# EasyEDA Pro project MIoTEvBoard_A.epro, schematic Schematic

## Sheets
1 Controller
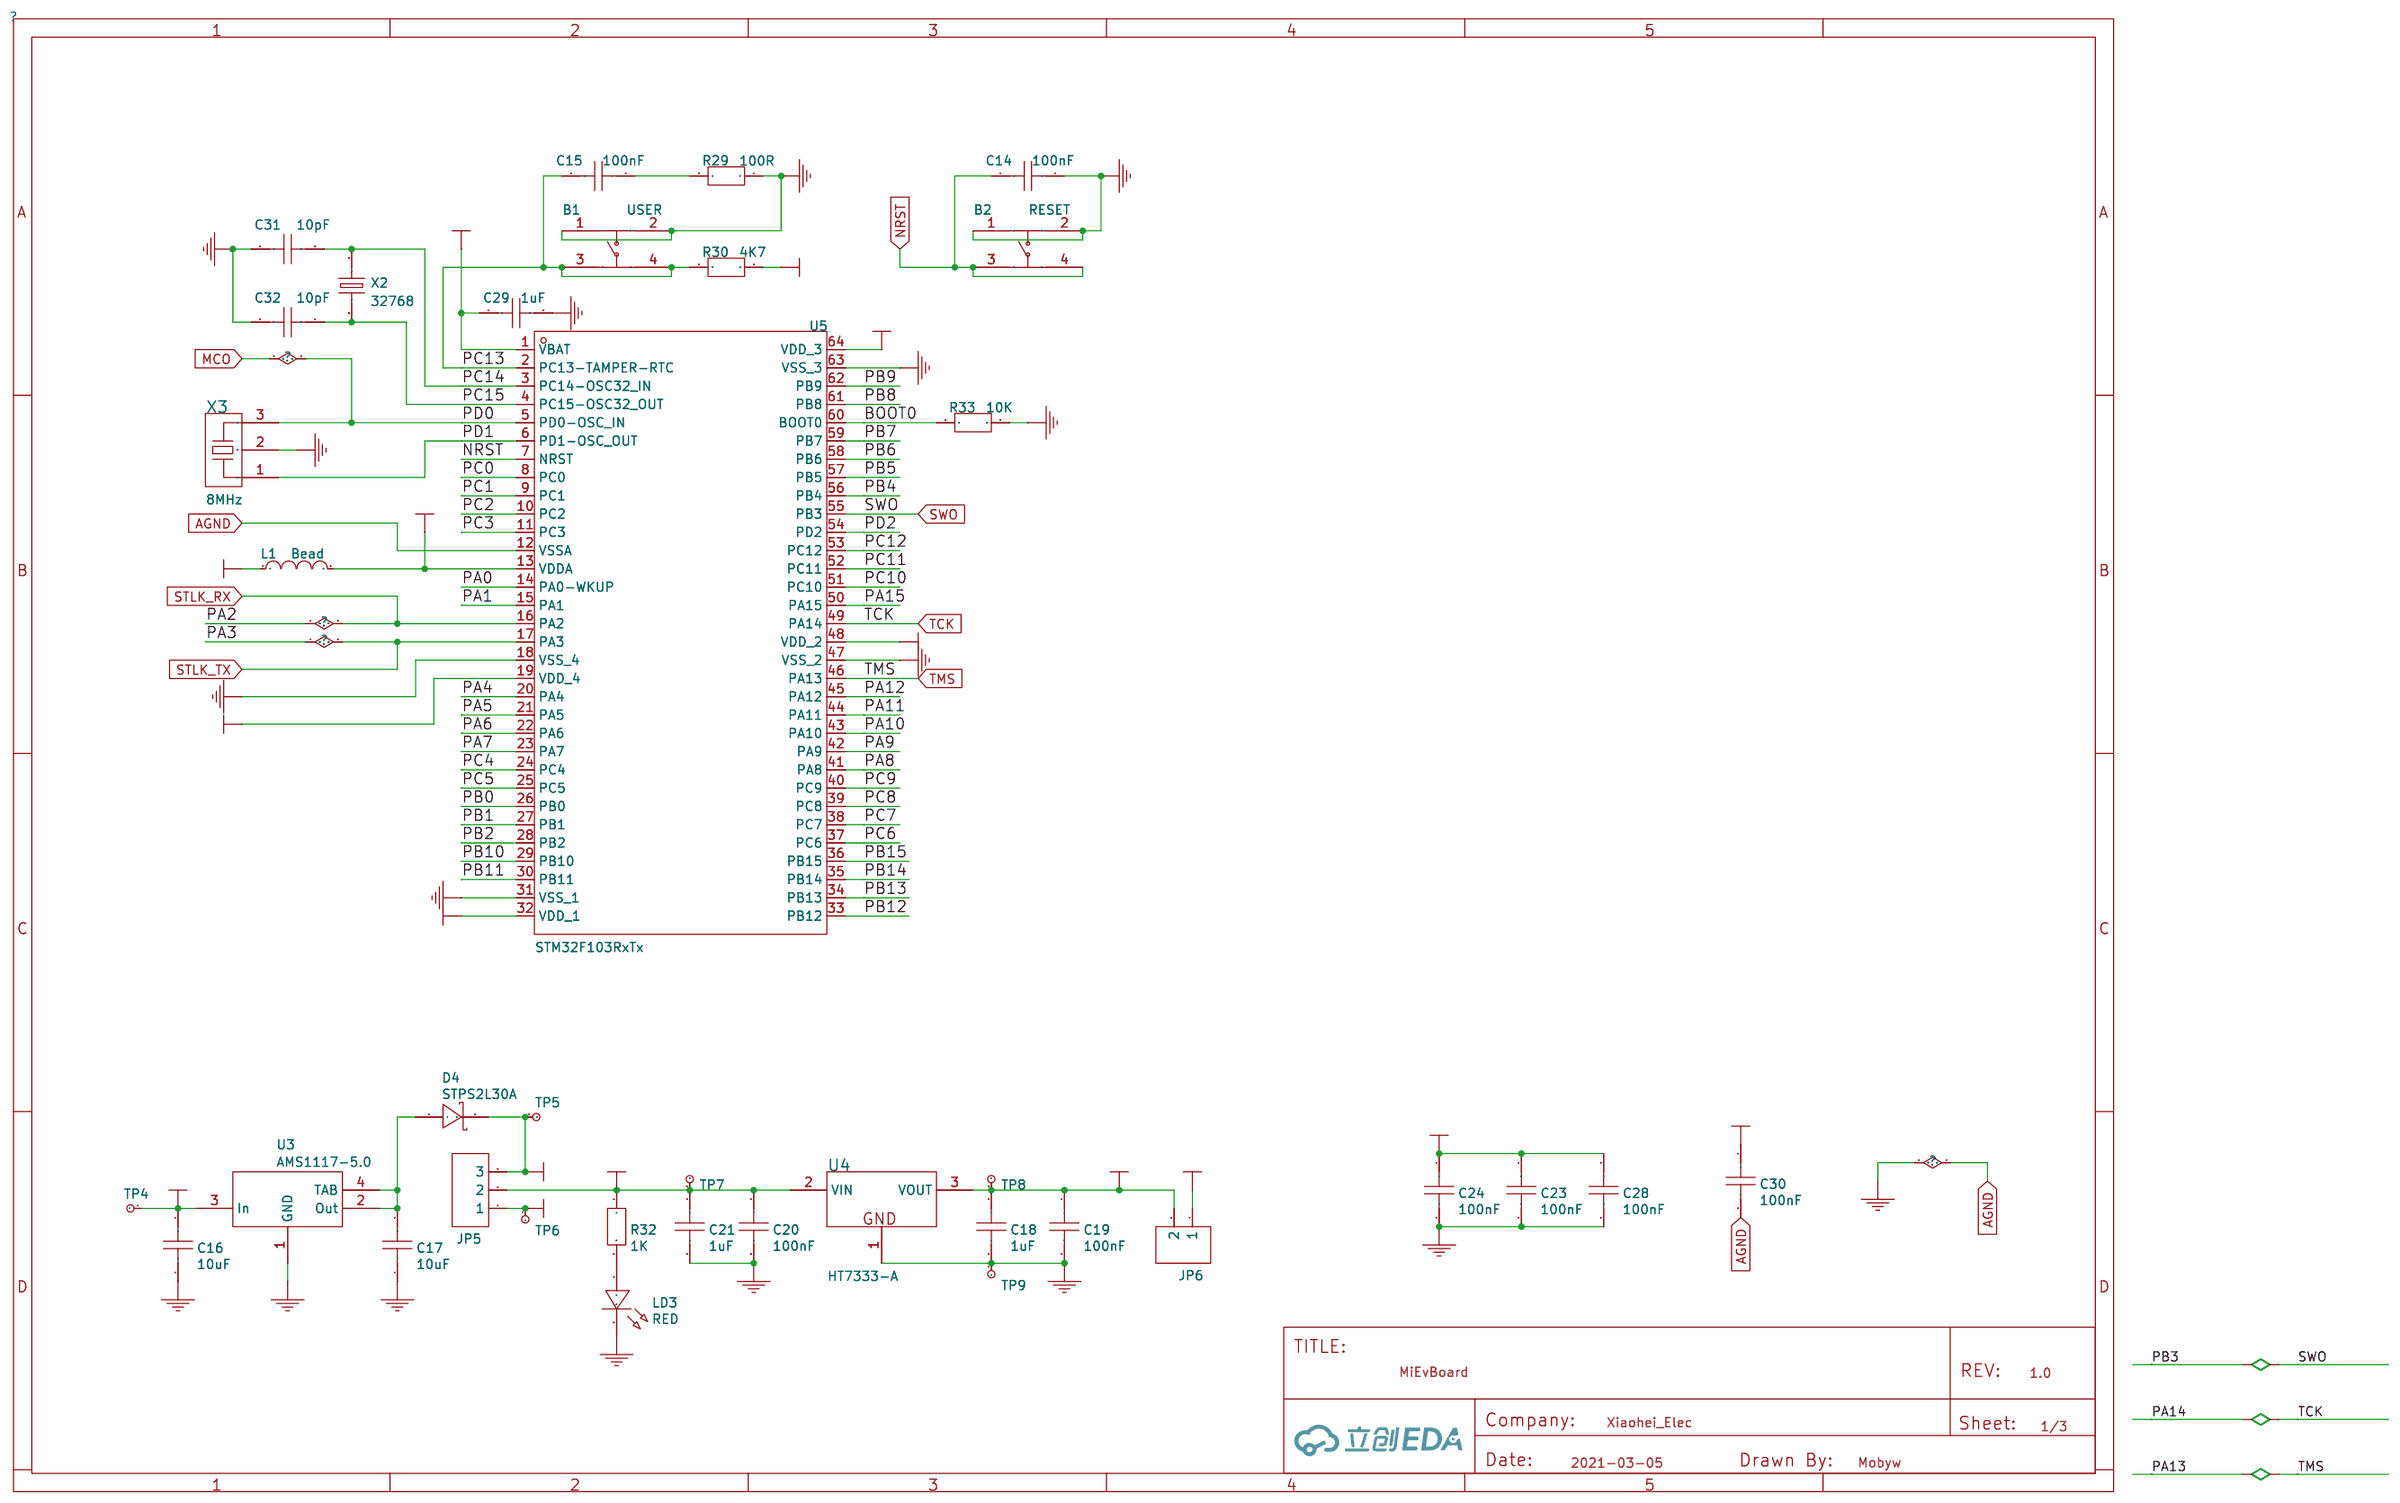
[diagram p0: Controller]
2 Simulator
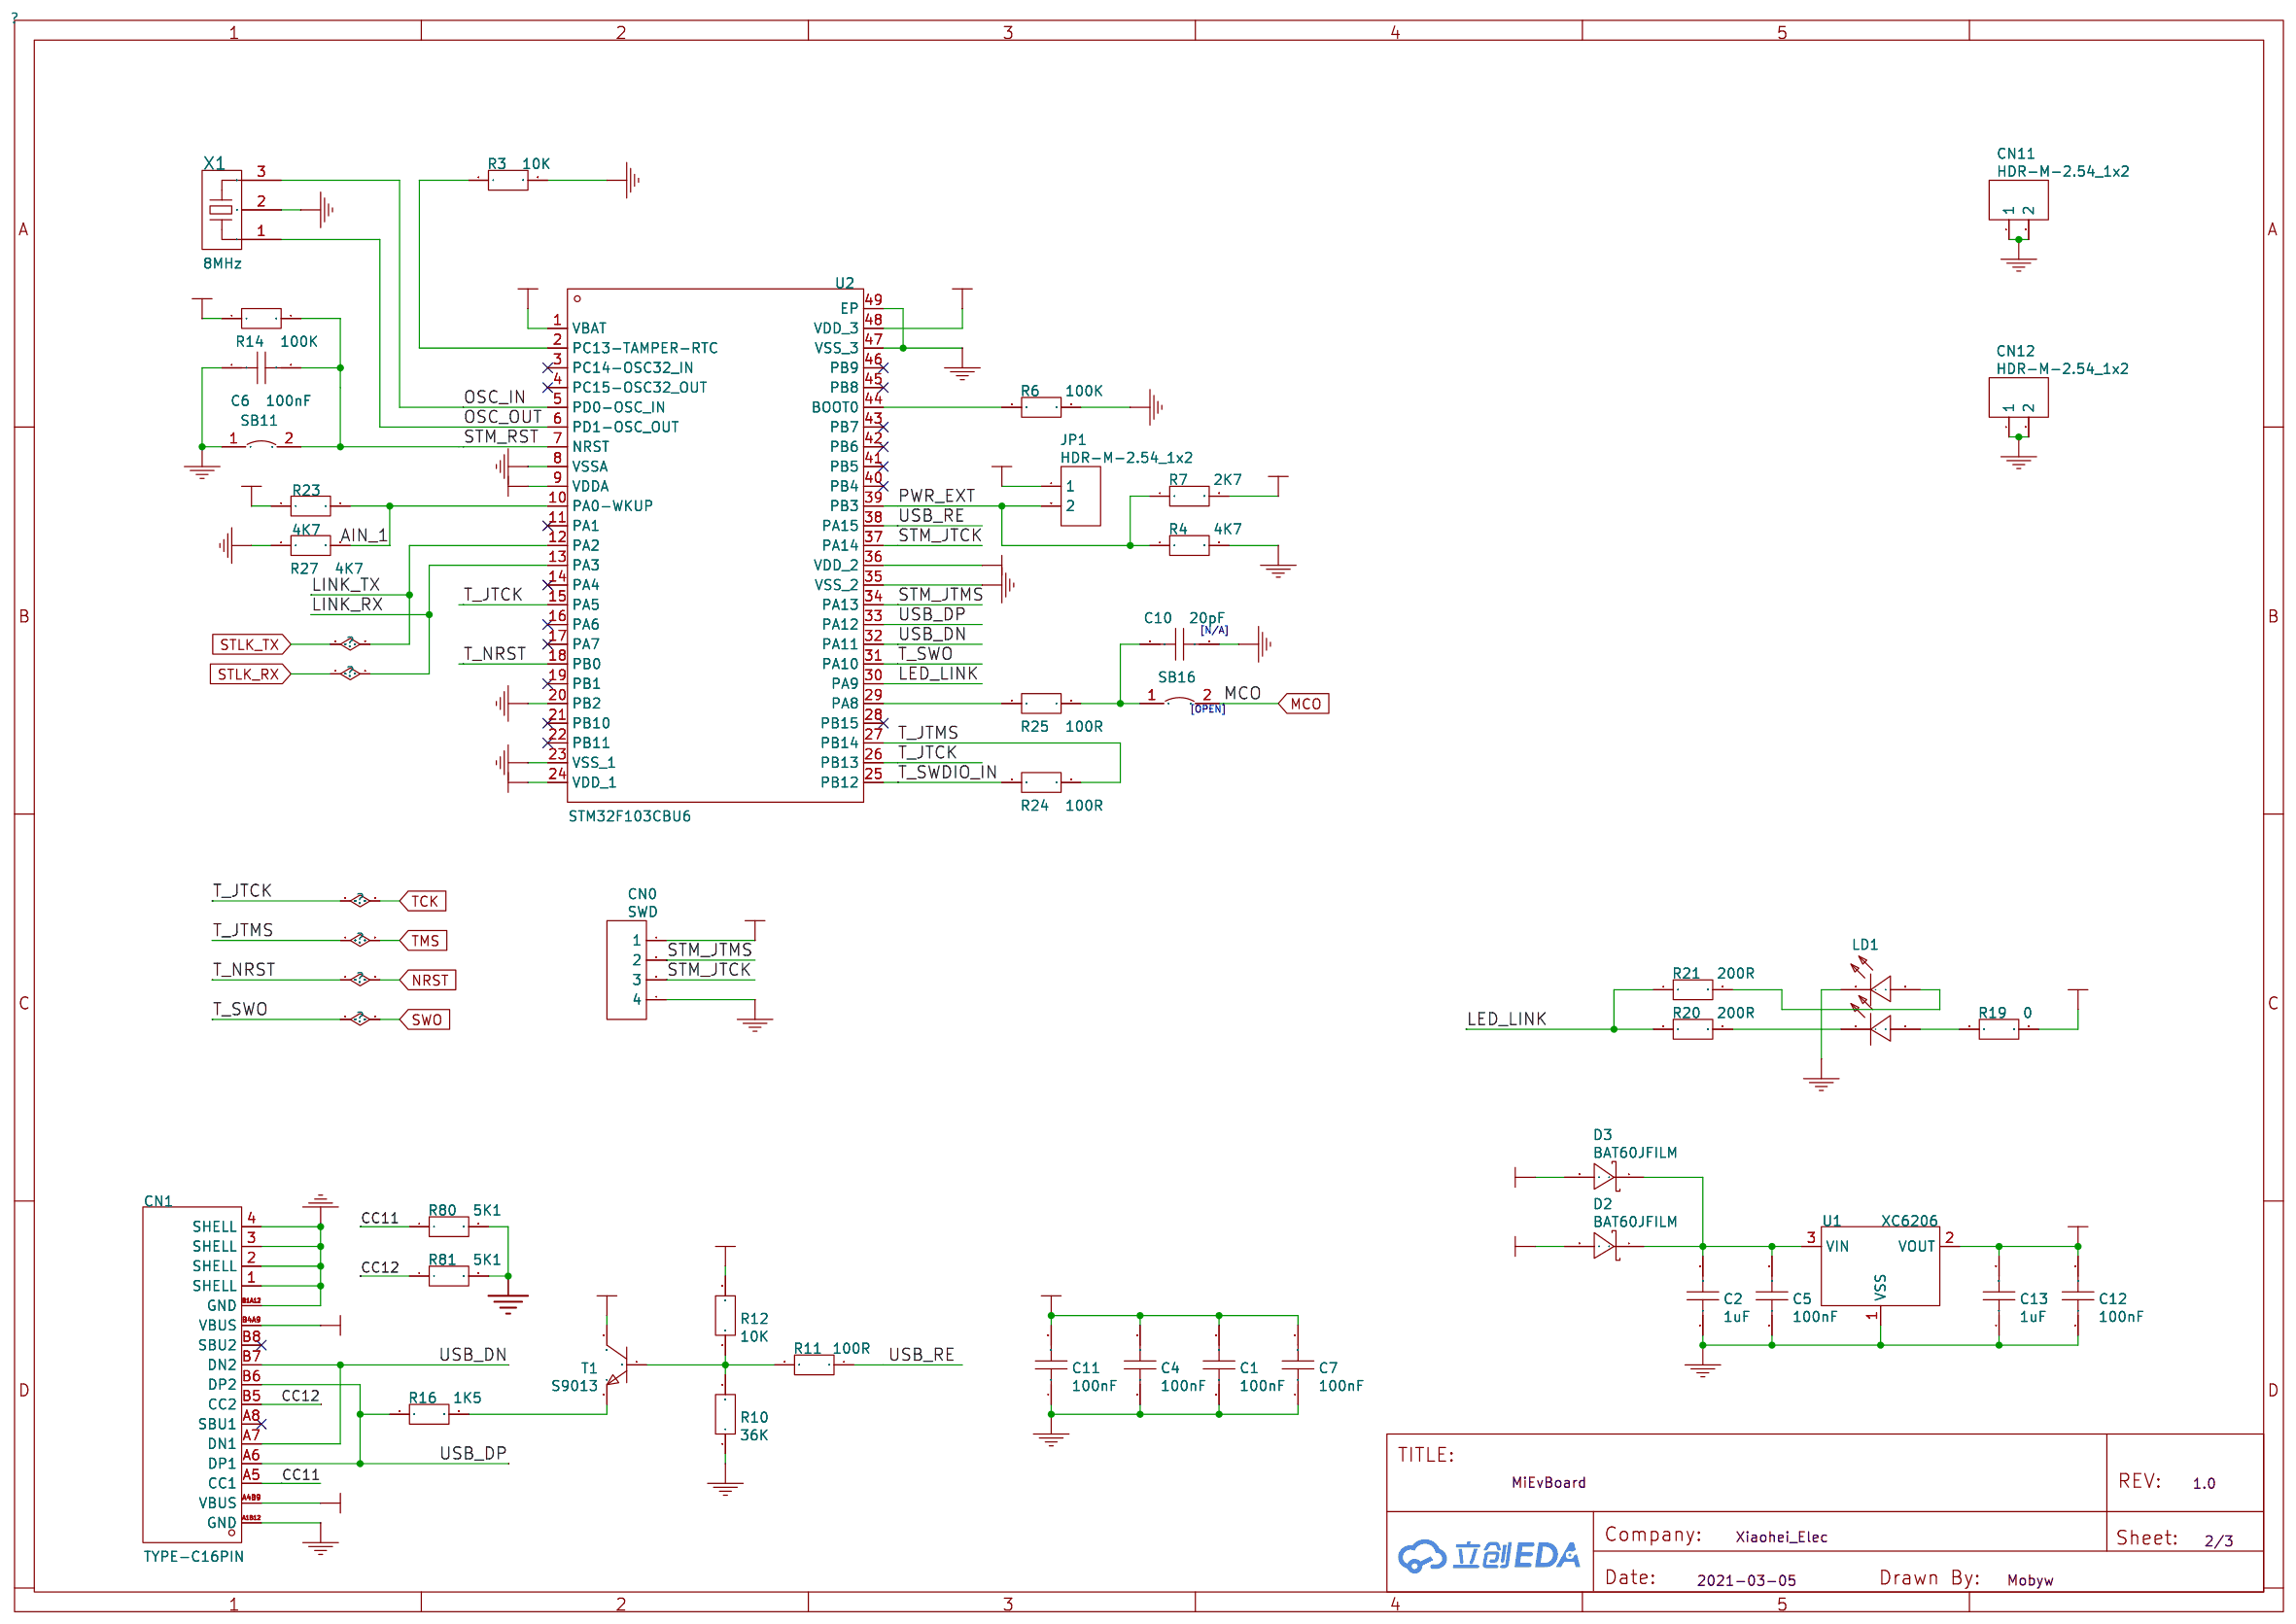
[diagram p1: Simulator]
3 Connector
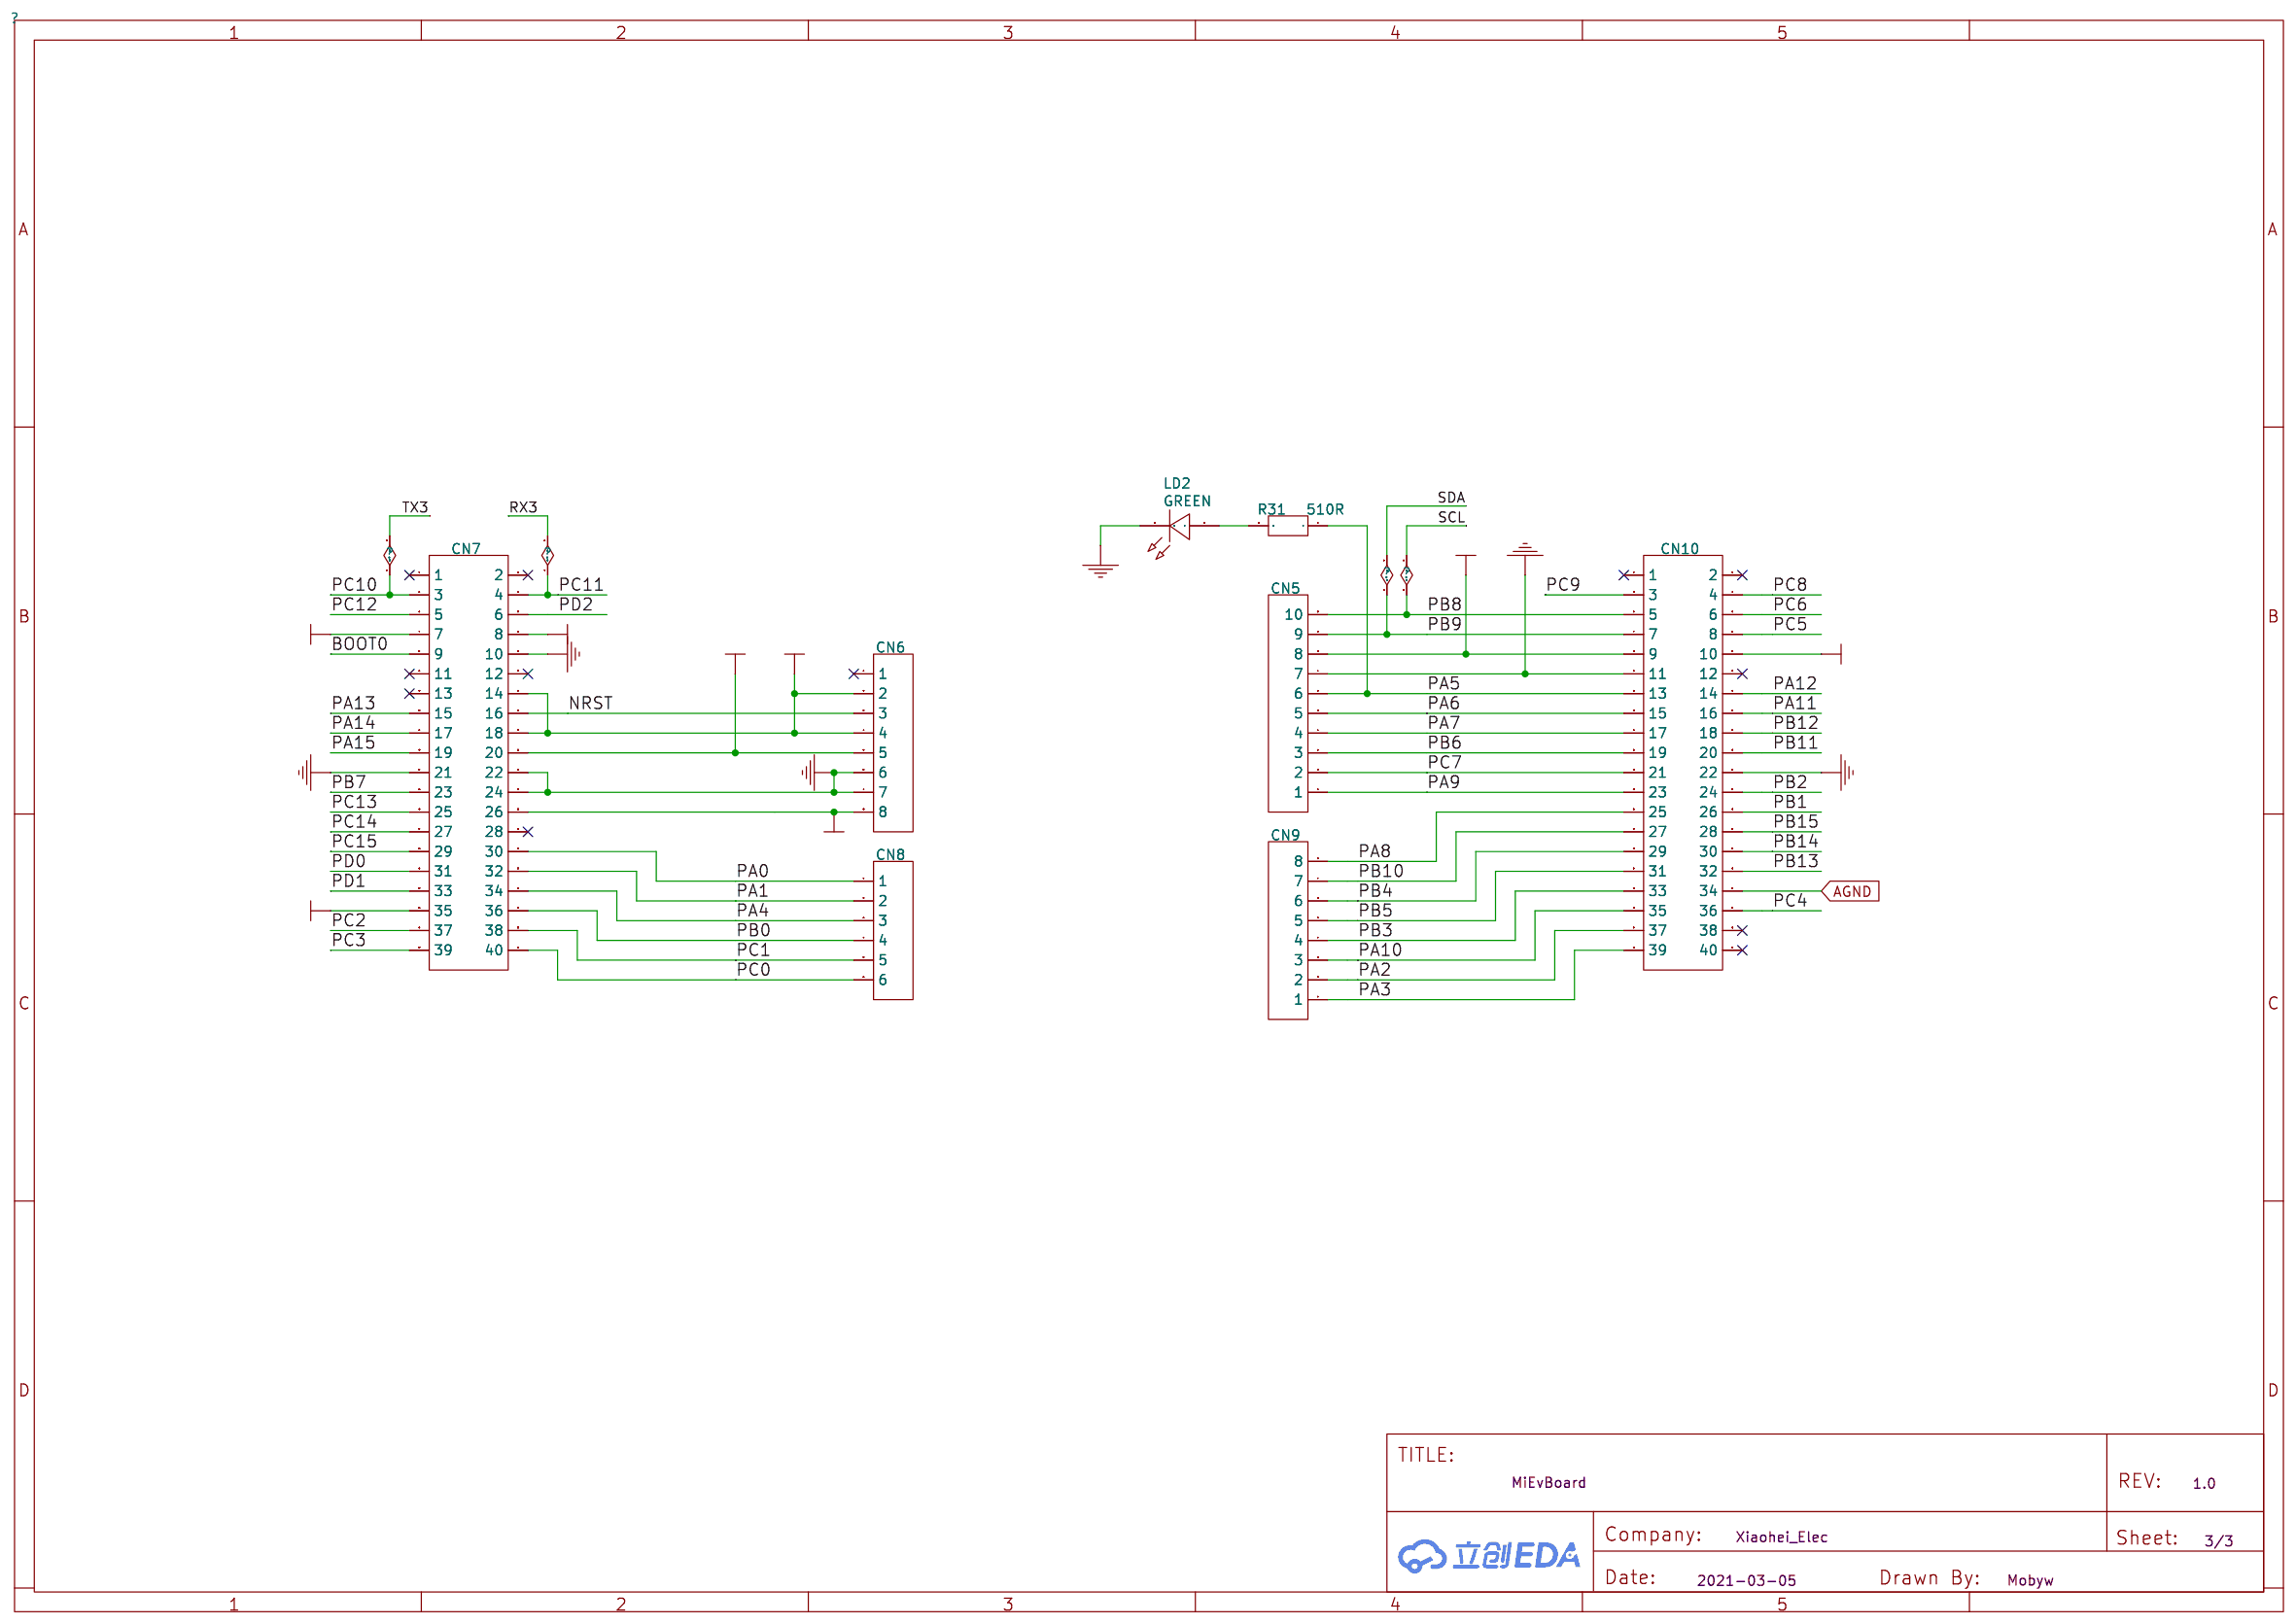
[diagram p2: Connector]
4 Communicator: Create Date: 2024-01-20; Page Name: Communicator; Project Name: MiEvBoard; Schematic Name: MI-NUCLEO-64; Update Date: 2024-01-21; Company: 嘉立创EDA; Page Size: A4; Version: V1.0
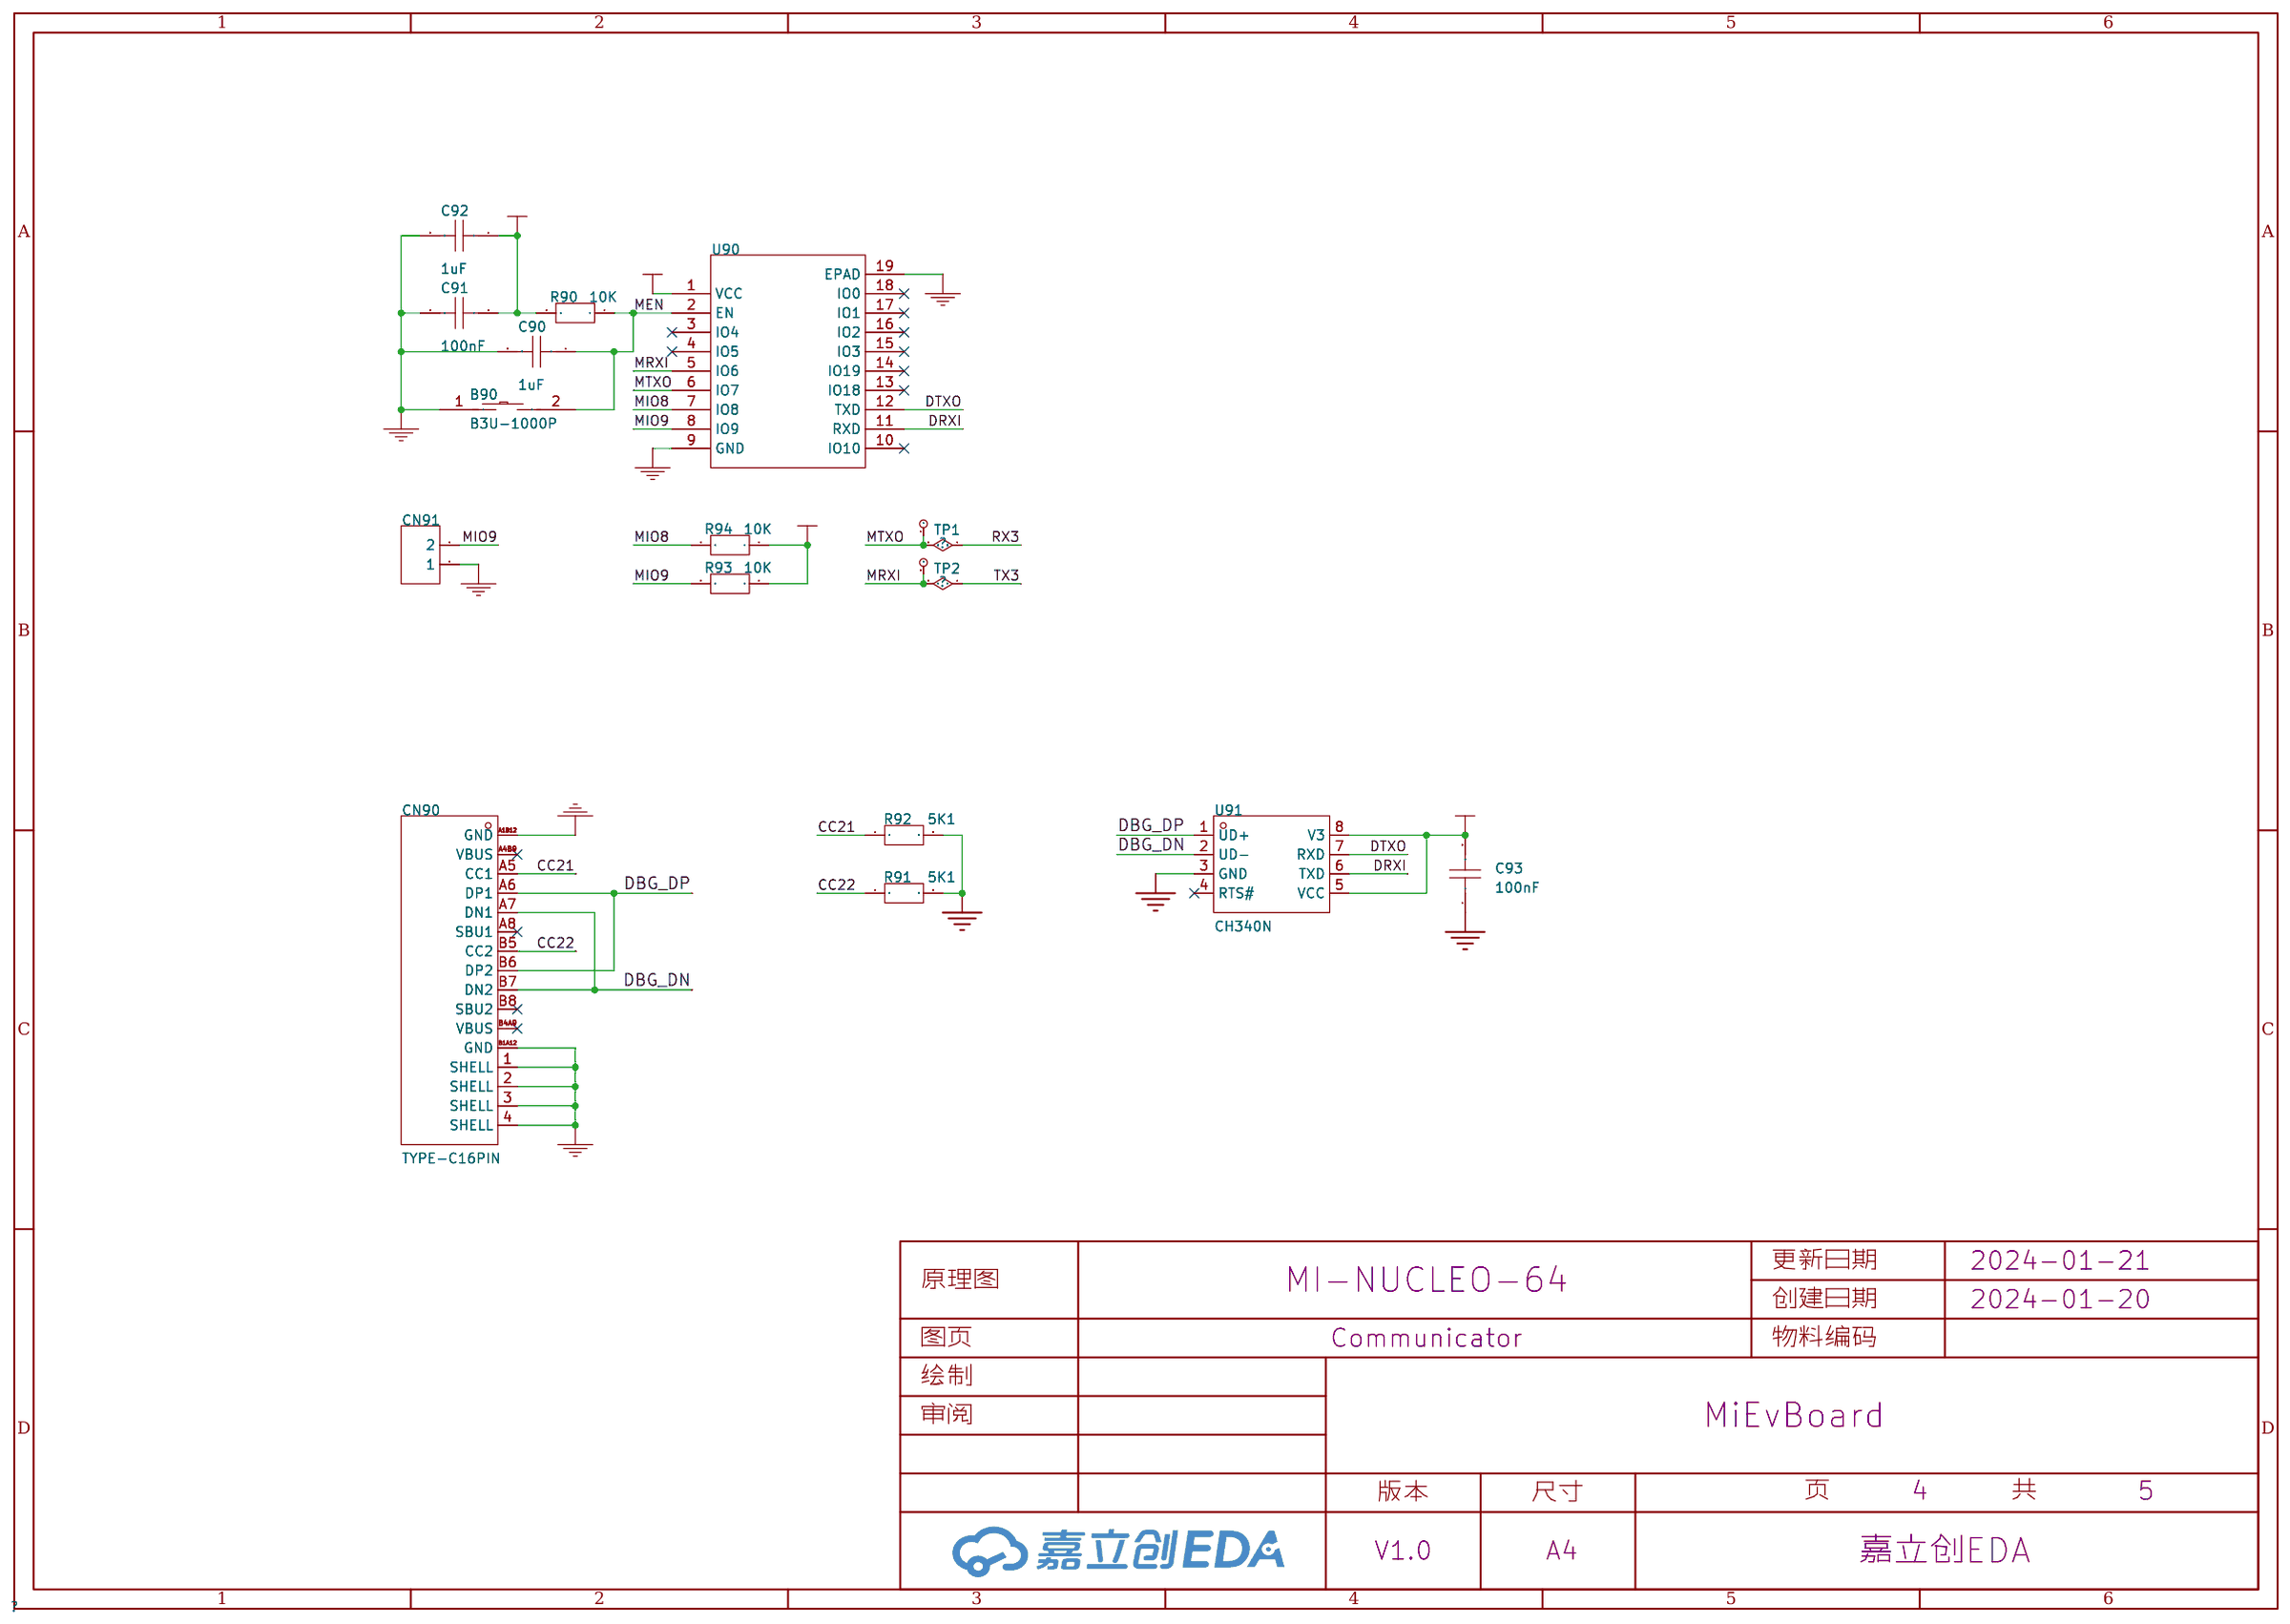
[diagram p3: Communicator]
5 Sensor: Create Date: 2024-01-21; Page Name: Sensor; Project Name: MiEvBoard; Schematic Name: MI-NUCLEO-64; Update Date: 2024-01-24; Company: 嘉立创EDA; Page Size: A4; Version: V1.0
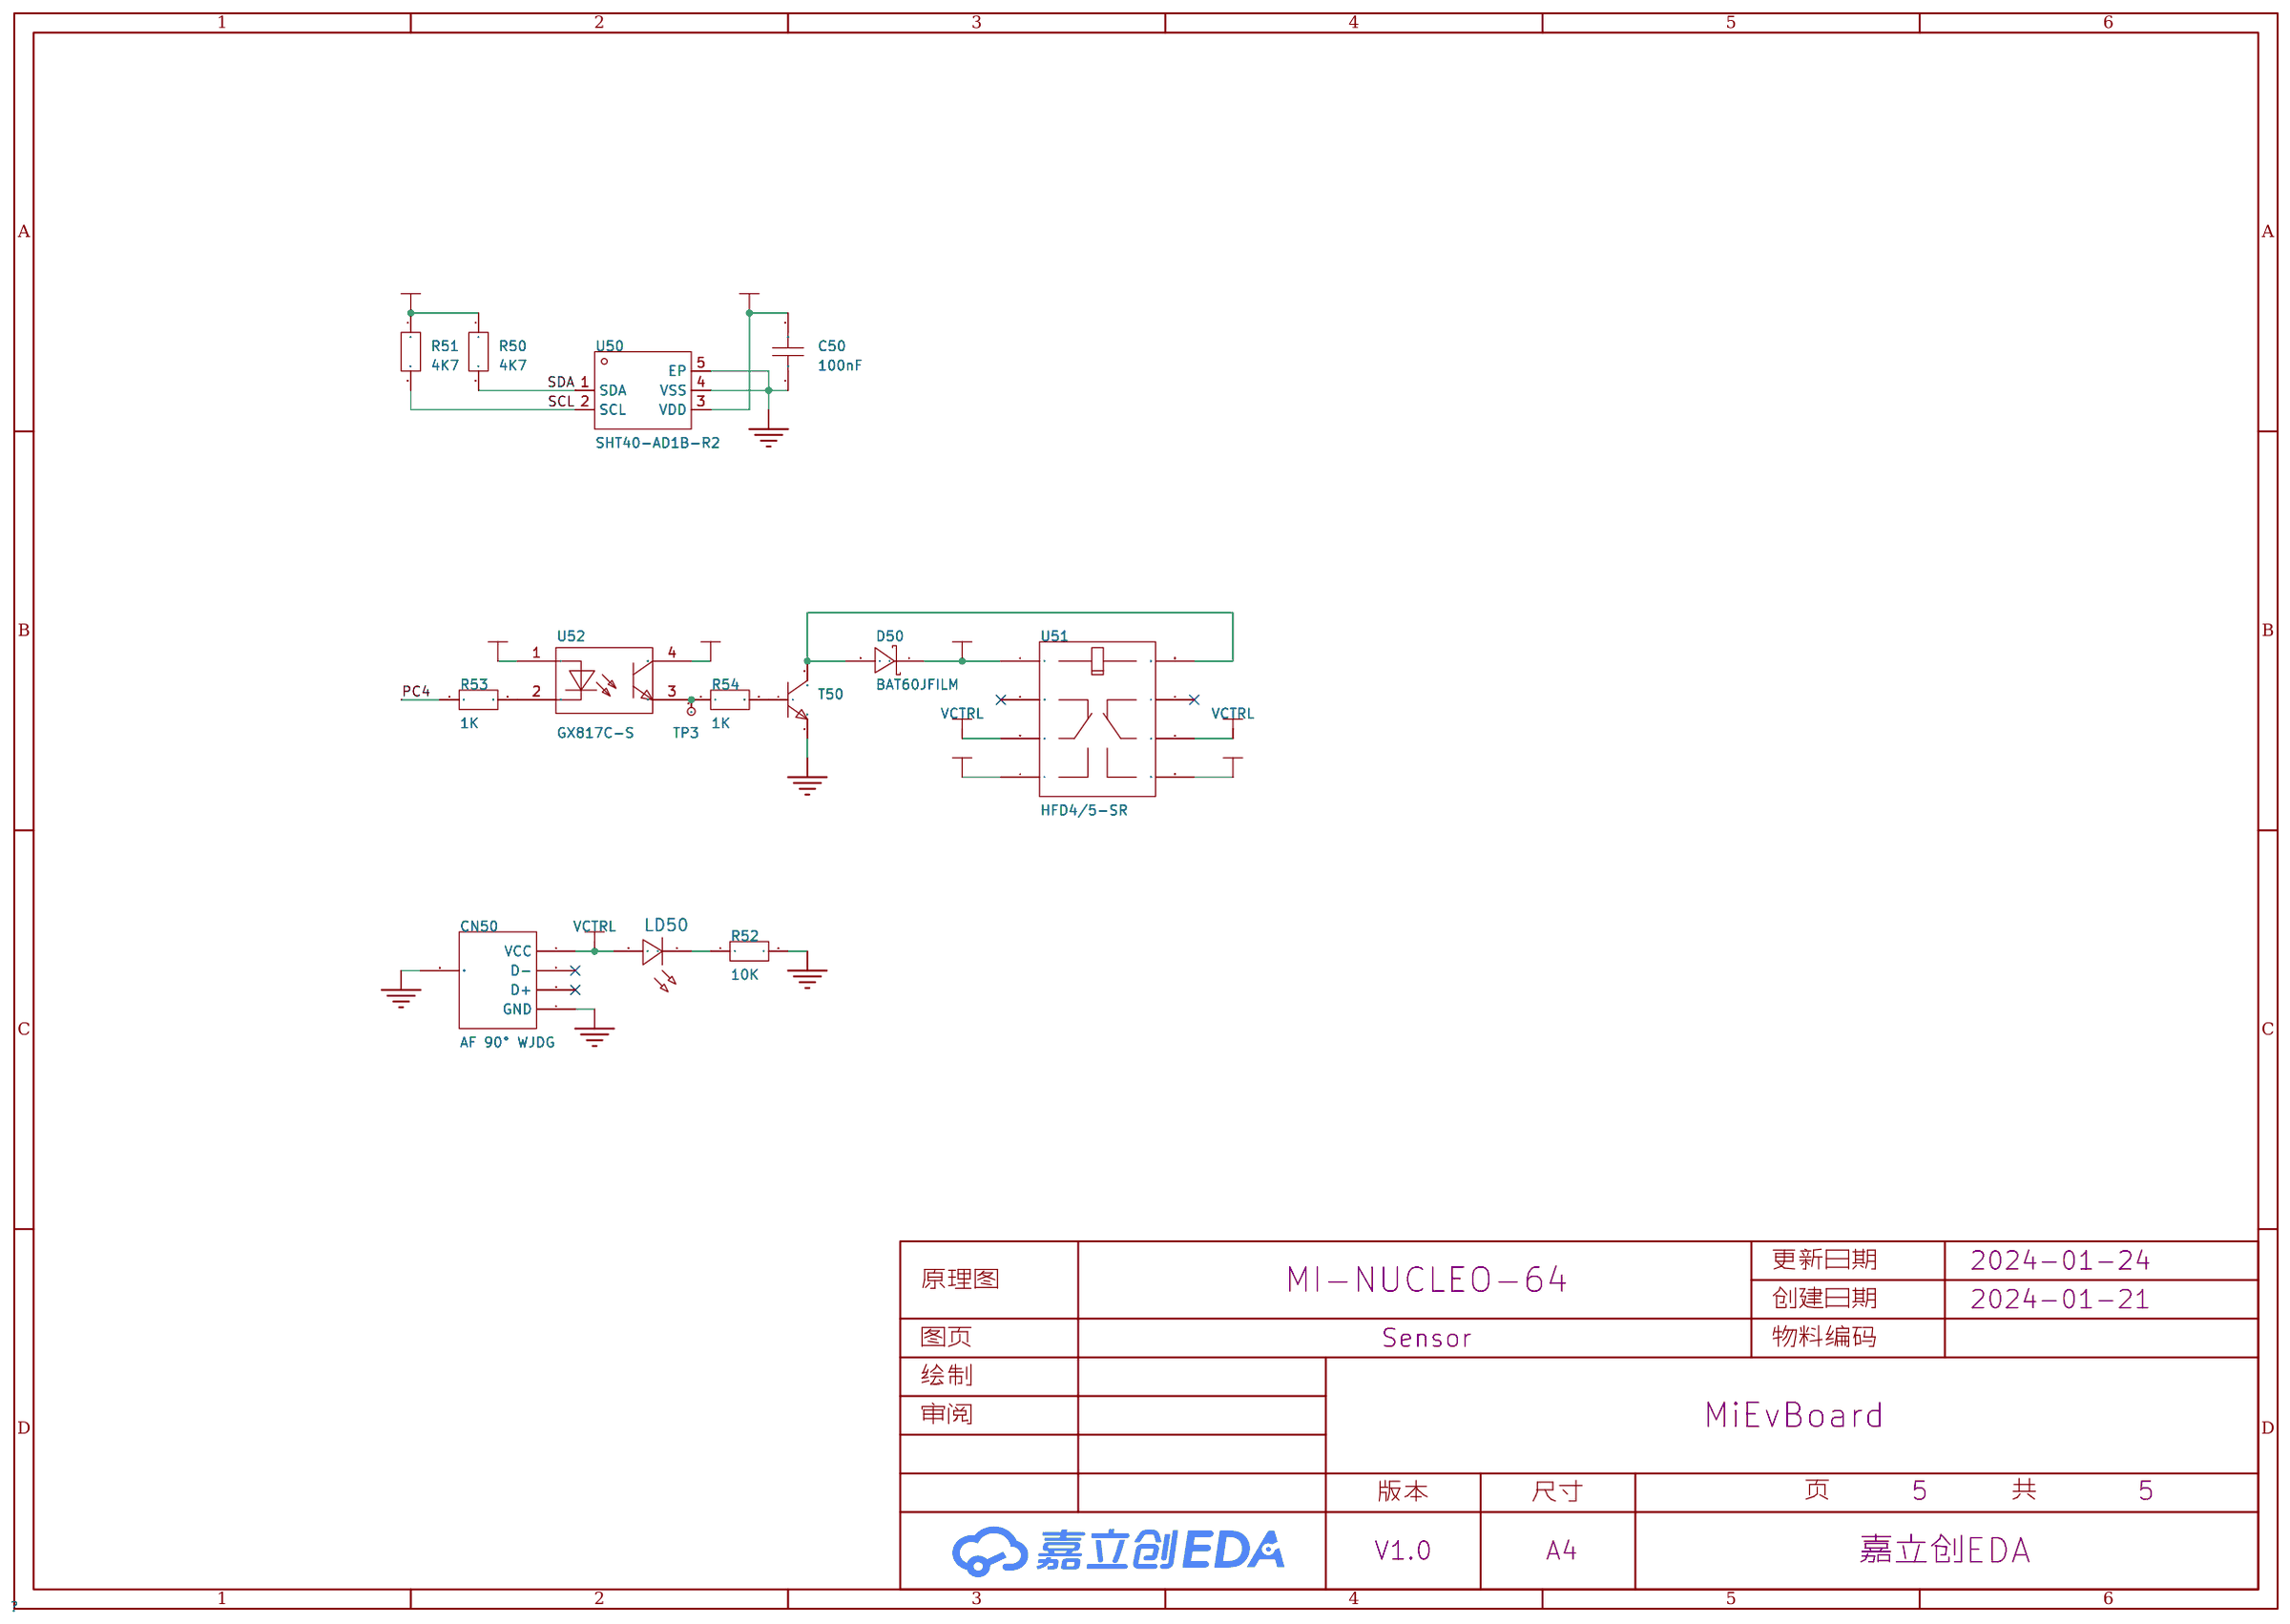
[diagram p4: Sensor]

## Parts
sheet Communicator
B90  B3U-1000P  [KEY-SMD_B3U-1000PM]
C90  1uF  [C0603]
C91  100nF  [C0603]
C92  1uF  [C0603]
C93  100nF  [C0603]
CN90  TYPE-C16PIN  [USB-C-SMD_TYPE-C16PIN]
CN91  HDR-M-2.54_1x2  [HDR-M-2.54_1X2]
R90  10K  [R0603]
R91  5K1  [R0603]
R92  5K1  [R0603]
R93  10K  [R0603]
R94  10K  [R0603]
TP1  -  [TP-Round-1.0]
TP2  -  [TP-Round-1.0]
U90  -  [MHCWB6G-B]
U91  CH340N  [SOP-8_L4.9-W3.9-P1.27-LS6.0-BL]
sheet Connector
CN5  HDR-F-2.54_1x10  [HDR-F-2.54_1X10]
CN6  HDR-F-2.54_1x8  [HDR-F-2.54_1X8]
CN7  HDR-M-2.54_2x20  [HDR-M-2.54_2X20]
CN8  HDR-F-2.54_1x6  [HDR-F-2.54_1X6]
CN9  HDR-F-2.54_1x8  [HDR-F-2.54_1X8]
CN10  HDR-M-2.54_2x20  [HDR-M-2.54_2X20]
LD2  GREEN  [LED0603_GREEN]
R31  510R  [R0603]
sheet Controller
B1  USER  [KEY-SMD_4P-L6.0-W6.0-P3.90-LS9.0]
B2  RESET  [KEY-SMD_4P-L6.0-W6.0-P3.90-LS9.0]
C14  100nF  [C0603]
C15  100nF  [C0603]
C16  10uF  [C0805]
C17  10uF  [C0805]
C18  1uF  [C0603]
C19  100nF  [C0603]
C20  100nF  [C0603]
C21  1uF  [C0603]
C23  100nF  [C0603]
C24  100nF  [C0603]
C28  100nF  [C0603]
C29  1uF  [C0603]
C30  100nF  [C0603]
C31  10pF  [C0603]
C32  10pF  [C0603]
D4  STPS2L30A  [SMA_L4.4-W2.8-LS5.4-RD]
JP5  HDR-M-2.54_1x3  [HDR-M-2.54_1X3]
JP6  HDR-M-2.54_1x2  [HDR-M-2.54_1X2]
L1  Bead  [L0603]
LD3  RED  [LED0603_RED]
R29  100R  [R0603]
R30  4K7  [R0603]
R32  1K  [R0603]
R33  10K  [R0603]
TP4  -  [TP-Round-1.0]
TP5  -  [TP-Round-1.0]
TP6  -  [TP-Round-1.0]
TP7  -  [TP-Round-1.0]
TP8  -  [TP-Round-1.0]
TP9  -  [TP-Round-1.0]
U3  AMS1117-5.0  [SOT-223_L6.5-W3.5-P2.30-LS7.0-BR]
U4  HT7333-A  [SOT-89-3_L4.5-W2.5-P1.50-LS4.2-BR]
U5  STM32F103RxTx  [LQFP-64_L10.0-W10.0-P0.50-LS12.0-BL]
X2  32768  [OSC-SMD_L3.2-W1.5]
X3  8MHz  [OSC-SMD_3P-L3.2-W1.3-P1.2-L]
sheet Sensor
C50  100nF  [C0603]
CN50  AF 90° WJDG  [USB-A-TH_AF-WJDG]
D50  BAT60JFILM  [SOD-323_L1.8-W1.3-LS2.5-RD]
LD50  -  [LED_0603]
R50  4K7  [R0603]
R51  4K7  [R0603]
R52  10K  [R0603]
R53  1K  [R0603]
R54  1K  [R0603]
T50  -  [S8050_SOT-23]
TP3  -  [TP-Round-1.0]
U50  SHT40-AD1B-R2  [DFN-4_L1.5-W1.5-P0.8-TL-EP]
U51  HFD4/5-SR  [RELAY-SMD_HFD4-5-SR]
U52  GX817C-S  [SOP-4_L6.5-W4.6-P2.54-LS10.2-TR]
sheet Simulator
C1  100nF  [C0603]
C2  1uF  [C0603]
C4  100nF  [C0603]
C5  100nF  [C0603]
C6  100nF  [C0603]
C7  100nF  [C0603]
C10  20pF  [C0603]
C11  100nF  [C0603]
C12  100nF  [C0603]
C13  1uF  [C0603]
CN0  SWD  [烧录点4P-2.54MM]
CN1  TYPE-C16PIN  [USB-C-SMD_TYPE-C16PIN]
CN11  HDR-M-2.54_1x2  [HDR-M-2.54_1X2]
CN12  HDR-M-2.54_1x2  [HDR-M-2.54_1X2]
D2  BAT60JFILM  [SOD-323_L1.8-W1.3-LS2.5-RD]
D3  BAT60JFILM  [SOD-323_L1.8-W1.3-LS2.5-RD]
JP1  HDR-M-2.54_1x2  [HDR-M-2.54_1X2]
LD1  MHT194CRCGCT  [LED-ARRAY-SMD_4P-0605-L1.60-W1.50-BL]
R3  10K  [R0603]
R4  4K7  [R0603]
R6  100K  [R0603]
R7  2K7  [R0603]
R10  36K  [R0603]
R11  100R  [R0603]
R12  10K  [R0603]
R14  100K  [R0603]
R16  1K5  [R0603]
R19  0  [R0603]
R20  200R  [R0603]
R21  200R  [R0603]
R23  4K7  [R0603]
R24  100R  [R0603]
R25  100R  [R0603]
R27  4K7  [R0603]
R80  5K1  [R0603]
R81  5K1  [R0603]
SB11  ShortPad  [SOLDERJUMPER_2_OPEN_0603]
SB16  ShortPad  [SOLDERJUMPER_2_OPEN_0603]
T1  S9013  [SOT-23-3_L2.9-W1.3-P1.90-LS2.4-BR]
U1  XC6206  [SOT-23-3_L2.9-W1.3-P1.90-LS2.4-BR]
U2  STM32F103CBU6  [UFQFPN-48_L7.0-W7.0-P0.50-BL-EP]
X1  8MHz  [OSC-SMD_3P-L3.2-W1.3-P1.2-L]

## Library data of the parts
B90 = B3U-1000P: 触点电流:50mA;额定电压(DC):12V;电路结构:单刀单掷;安装方式:立贴;带灯:-;机械寿命:-;; LCSC Part Name: 3*2.5*1.6mm 立贴 轻触开关; Supplier Part: C231329; Manufacturer: OMRON(欧姆龙); Supplier Footprint: SMD,2.5x3mm; JLCPCB Part Class: 扩展库; Datasheet: https://atta.szlcsc.com/upload/public/pdf/source/20180629/C231329_070179C33643744C5978F4F02109B85D.pdf; Supplier: LCSC; Contact Current: 50mA; Voltage Rating (DC): 12V; Circuit: 单刀单掷; Mounting Style: 立贴; Actuator Style: 圆形按钮; Switch Length: 3mm; Switch Width: 2.5mm; Switch Height: 1.6mm
C2 C13 C18 C21 C29 C90 C92 = 1uF: link: https://item.szlcsc.com/362304.html; 3DModel: C0603_L1.6-W0.8-H0.8
C1 C4-C7 C11 C12 C14 C15 C19 C20 C23 C24 C28 C30 C50 C91 C93 = 100nF: link: https://item.szlcsc.com/362304.html; 3DModel: C0603_L1.6-W0.8-H0.8
CN1 CN90 = TYPE-C16PIN: 连接器类型:Type-C;标准:-;公母:母;端口数量:1;触点数量:16P;安装方式:卧贴;额定电流 - 电源:3A;工作温度范围:-40℃~+85℃;; LCSC Part Name: Type-C 母 卧贴; Supplier Part: C393939; Manufacturer: SHOU HAN(首韩); Supplier Footprint: SMD; JLCPCB Part Class: 扩展库; Datasheet: https://atta.szlcsc.com/upload/public/pdf/source/20190521/C393939_7B9043D4CF1026AF443AB60D91FBCD5C.pdf; Supplier: LCSC; Connector Type: Type-C; Gender: 母; Number of Ports: 1; Number of Contacts: 16P; Mounting Style: 卧贴; Current Rating - Power (Max): 3A; Operating Temperature Range: -40℃~+85℃
CN11 CN12 CN91 JP1 JP6 = HDR-M-2.54_1x2: Supplier Part: C124375; Supplier: LCSC
R3 R12 R33 R50-R54 R90 R93 R94 = 10K: link: https://item.szlcsc.com/137208.html; 3DModel: R0603_L1.6-W0.8-H0.8
R16 R80 R81 R91 R92 = 1K5: link: https://item.szlcsc.com/137208.html; 3DModel: R0603_L1.6-W0.8-H0.8
TP1-TP9 = TP-Round
U90 = MHCWB6G-B
U91 = CH340N: LCSC Part Name: USB转串口芯片 CH340; Supplier Part: C2977777; Manufacturer: WCH(南京沁恒); Supplier Footprint: SOP-8; JLCPCB Part Class: 扩展库; Datasheet: https://atta.szlcsc.com/upload/public/pdf/source/20230530/6E401E9554E9F5311886CC8B3F89B62E.pdf; Supplier: LCSC
CN5 = HDR-F-2.54_1x10: Supplier Part: C35445; Supplier: LCSC
CN6 CN9 = HDR-F-2.54_1x8: Supplier Part: C225505; Supplier: LCSC
CN7 CN10 = HDR-M-2.54_2x20: Supplier Part: C50980; Supplier: LCSC
CN8 = HDR-F-2.54_1x6: Supplier Part: C40877; Supplier: LCSC
LD2 = GREEN: 3DModel: LED0603_Green; Manufacturer: EVERLIGHT(台湾亿光); Manufacturer Part: 19-217/GHC-YR1S2/3T; Supplier Part: C72043; Supplier: LCSC
R31 = 510R: link: https://item.szlcsc.com/137208.html; 3DModel: R0603_L1.6-W0.8-H0.8
B1 = USER: 触点电流:50mA;额定电压(DC):12V;绝缘电阻:100MΩ;电路结构:单刀单掷;安装方式:立贴;按钮形状:圆形按钮;带灯:-;作用力:250gf@±30gf;机械寿命:1000000;工作温度:-25℃~+85℃;开关长度:6mm;开关宽度:6mm;开关高度:9mm;; link: https://item.szlcsc.com/140748.html; 3DModel: KEY-SMD_4P-L6.0-W6.0-H9.0-LS10.0-P3.9; Supplier: LCSC; Supplier Part: C155494; Manufacturer: Rectangular Connectors - Contacts; Manufacturer Part: K2-6639SP-K4SC-04; LCSC Part Name: K2-6639SP-K4SC-04; Supplier Footprint: SMD; JLCPCB Part Class: Extended Part; Datasheet: https://atta.szlcsc.com/upload/public/pdf/source/20200721/C707344_FB3B602593668C8FE1542A3F64DDEE0A.pdf; Contact Current: 50mA; Voltage Rating (DC): 12V; Insulation Resistance: 100MΩ; Circuit: 单刀单掷; Mounting Style: 立贴; Actuator Style: 圆形按钮; Operating Force: 250gf@±30gf; Mechanical Life: 1000000; Operating Temperature: -25℃~+85℃; Switch Length: 6mm; Switch Width: 6mm; Switch Height: 9mm
B2 = RESET: 触点电流:50mA;额定电压(DC):12V;绝缘电阻:100MΩ;电路结构:单刀单掷;安装方式:立贴;按钮形状:圆形按钮;带灯:-;作用力:250gf@±30gf;机械寿命:1000000;工作温度:-25℃~+85℃;开关长度:6mm;开关宽度:6mm;开关高度:9mm;; link: https://item.szlcsc.com/140748.html; 3DModel: KEY-SMD_4P-L6.0-W6.0-H9.0-LS10.0-P3.9; Supplier: LCSC; Supplier Part: C155494; Manufacturer: Rectangular Connectors - Contacts; Manufacturer Part: K2-6639SP-K4SC-04; LCSC Part Name: K2-6639SP-K4SC-04; Supplier Footprint: SMD; JLCPCB Part Class: Extended Part; Datasheet: https://atta.szlcsc.com/upload/public/pdf/source/20200721/C707344_FB3B602593668C8FE1542A3F64DDEE0A.pdf; Contact Current: 50mA; Voltage Rating (DC): 12V; Insulation Resistance: 100MΩ; Circuit: 单刀单掷; Mounting Style: 立贴; Actuator Style: 圆形按钮; Operating Force: 250gf@±30gf; Mechanical Life: 1000000; Operating Temperature: -25℃~+85℃; Switch Length: 6mm; Switch Width: 6mm; Switch Height: 9mm
C16 C17 = 10uF: link: https://item.szlcsc.com/373011.html; 3DModel: C0805_L2.0-W1.3-H1.3
C31 C32 = 10pF: link: https://item.szlcsc.com/362304.html; 3DModel: C0603_L1.6-W0.8-H0.8
D4 = STPS2L30A: 3DModel: SMA_L4.4-W2.8-H2.1-LS5.4; link: https://so.szlcsc.com/global.html?c=&k=C50840; Supplier: LCSC; Manufacturer: STMicroelectronics; Supplier Part: C133102; Paste Type: expand; Assembly Type: smtWeld
JP5 = HDR-M-2.54_1x3: Supplier Part: C180248; Supplier: LCSC
L1 = 100uH: link: https://item.szlcsc.com/344093.html; 3DModel: L0603_L1.6-W0.8-H0.5_BEAD
LD3 = RED: 3DModel: LED0603_Red; Manufacturer: EVERLIGHT(台湾亿光); Manufacturer Part: 19-217/R6C-AL1M2VY/3T; Supplier Part: C72044; Supplier: LCSC
R11 R24 R25 R29 = 100R: link: https://item.szlcsc.com/137208.html; 3DModel: R0603_L1.6-W0.8-H0.8
R4 R23 R27 R30 = 4K7: link: https://item.szlcsc.com/137208.html; 3DModel: R0603_L1.6-W0.8-H0.8
R32 = 1K: link: https://item.szlcsc.com/137208.html; 3DModel: R0603_L1.6-W0.8-H0.8
U3 = AMS1117-5.0_C6187: 输出类型:固定;最大输入电压:12V;输出电压:5V;输出电流:1A;电源纹波抑制比(PSRR):68dB@(120Hz);输出极性:正;; LCSC Part Name: 输入12V 输出5V 1A; Supplier Part: C6187; Manufacturer: AMS; Supplier Footprint: SOT-223; JLCPCB Part Class: Basic Part; Datasheet: https://atta.szlcsc.com/upload/public/pdf/source/20230918/E4B716057EE82179D88E8A0894830D59.pdf; Supplier: LCSC; Output Type: 固定; Maximum Input Voltage: 12V; Output Voltage: 5V; Output Current: 1A; Power Supply Rejection Ratio (PSRR): 68dB@(120Hz); Dropout Voltage: 1.3V@(1A); Output Polarity: 正; Number of Outputs: 1; link: https://item.szlcsc.com/109711.html; 3DModel: SOT-223-4P_L6.5-W3.5-H1.6-LS7.0-P2.30; Paste Type: base; Assembly Type: smtWeld; image: //image.lceda.cn/szlcsc/C6187.jpg
U4 = HT7333-A_C5451670: 输出类型:固定;最大输入电压:18V;输出电压:3.3V;输出电流:250mA;输出极性:正;; LCSC Part Name: Vin:18V Vout:3.3V 250mA; Supplier Part: C5451670; Manufacturer: HXY MOSFET(华轩阳电子); Supplier Footprint: SOT-89; JLCPCB Part Class: 扩展库; Datasheet: https://atta.szlcsc.com/upload/public/pdf/source/20230427/0C2ED0810C4CDC8441350A12EE5F2F10.pdf; Supplier: LCSC; Output Type: 固定; Maximum Input Voltage: 18V; Output Voltage: 3.3V; Output Current: 250mA; Output Polarity: 正; Number of Outputs: 1
U5 = STM32F103RCT6: CPU内核:ARM Cortex-M3;CPU最大主频:72MHz;工作电压范围:2V~3.6V;程序存储容量:256KB;程序存储器类型:FLASH;RAM总容量:48KB;GPIO端口数量:51;; Supplier Part: C8323; Manufacturer: ST(意法半导体); Supplier Footprint: LQFP-64(10x10); JLCPCB Part Class: Extended Part; Datasheet: https://atta.szlcsc.com/upload/public/pdf/source/20180207/C88442_15179953708671359491.pdf; Supplier: LCSC; CPU Core: ARM Cortex-M3; CPU Maximum Speed: 72MHz; Operating Voltage Range: 2V~3.6V; Program Storage Size: 256KB; Program Memory Type: FLASH; RAM Size: 48KB; GPIO Ports Number: 51; ADC (Bit): 12bit; DAC (Bit): 12bit; Universal Serial Bus: 有; Peripheral/Function: DMA；片载温度传感器；PWM; Watchdog: 有; Infrared Data Association: 有; Low-Voltage Detect: 有; Direct Memory Access: 有; Internal Oscillator: 有; Operating Temperature Range: -40℃~+85℃
X2 = 32.768KHz: link: https://item.szlcsc.com/100222.html; 3DModel: OSC-SMD_L3.2-W1.5-H0.8; Supplier: LCSC; Supplier Part: C295064; Manufacturer: TAITIEN Elec; Manufacturer Part: XDMCZLNDDF-32.768KHZ; Paste Type: expand; Assembly Type: smtWeld
X1 X3 = CSTCE8M00G15C99-R0: 频率:8MHz;频率容差:±0.1%;内置负载电容:33pF;谐振阻抗:40Ω;; LCSC Part Name: 8MHz ±0.1% 内置负载电容:33pF; Supplier Part: C110614; Manufacturer: muRata(村田); Supplier Footprint: SMD3213-3P; JLCPCB Part Class: 扩展库; Datasheet: https://atta.szlcsc.com/upload/public/pdf/source/20180327/C110614_9F5031E08ADB10DE4472527BF78A8CAF.pdf; Supplier: LCSC; Frequency Stability: ±0.13%; Frequency Tolerance: ±0.1%; Built-in Load Capacitance: 33pF; Resonant Impedance: 40Ω; Operating Temperature: -40℃~+125℃
CN50 = AF 90° WJDG: 连接器类型:Type-A;标准:USB 2.0;公母:母;端口数量:1;触点数量:4P;安装方式:弯插;额定电流 - 电源:1.5A;工作温度范围:-25℃~+85℃;; LCSC Part Name: Type-A 母 弯插; Supplier Part: C456018; Manufacturer: SHOU HAN(首韩); Supplier Footprint: 插件; JLCPCB Part Class: 扩展库; Datasheet: https://atta.szlcsc.com/upload/public/pdf/source/20191113/C456018_B104E062BEB8E11E57E63560E04EE13A.pdf; Supplier: LCSC; Connector Type: Type-A; Standard: USB 2.0; Gender: 母; Number of Ports: 1; Number of Contacts: 4P; Mounting Style: 弯插; Current Rating - Power (Max): 1.5A; Operating Temperature Range: -25℃~+85℃
D2 D3 D50 = BAT60JFILM: link: https://item.szlcsc.com/295156.html; 3DModel: SOD-323_L1.7-W1.3-H1.1-LS2.5; Supplier: LCSC; Manufacturer: STMicroelectronics; Supplier Part: C133103; Paste Type: expand; Assembly Type: smtWeld
LD50 = LED_0603-R: Supplier Footprint: 0603
T50 = S8050_SOT_NPN: Supplier Footprint: SOT-23
U50 = SHT40-AD1B-R2: 3.000.465; Supplier Part: C2909890; Manufacturer: Sensirion(瑞士盛思锐); Supplier Footprint: DFN-4-EP(1.5x1.5); JLCPCB Part Class: 扩展库; Datasheet: https://atta.szlcsc.com/upload/public/pdf/source/20211021/851BA36A5CA574D725310F52CADA4510.pdf; Supplier: LCSC
U51 = HFD4/5-SR: 引脚数:8;线圈电压:5V;触点形式:两组转换:2C(双刀双掷-转换);触点容量(电阻负载):1A@30VDC；300mA@125VAC;触点材料:AgNi+镀金;; LCSC Part Name: 超小型5V继电器 双刀双掷; Supplier Part: C64399; Manufacturer: HF(宏发); Supplier Footprint: SMD,6.5x10mm; JLCPCB Part Class: Extended Part; Datasheet: https://atta.szlcsc.com/upload/public/pdf/source/20170415/1492238463316.pdf; Supplier: LCSC; Pin Number: 8; Coil Voltage: 5V; Coil Rated Power: 140mW; Contact Form: 两组转换:2C(双刀双掷-转换); Contact Rating: 1A@30VDC；300mA@125VAC; Coil Resistance: 178Ω; Maximum Switching Voltage: 250V@AC；220V@DC; Maximum Switching Current: 2A; Operate Time: 3ms; Release Time: 3ms; Coil Type: 极化-单线圈; Contact Resistance: 100mΩ; Contact Material: AgNi+镀金; Operating Temperature: -40℃~+85℃
U52 = GX817C-S: 输入电压类型:DC;正向电压:1.2V;输出电流:50mA;隔离电压(rms):5kV;反向电压:6V;接收端电压:35V;输出通道数:1;集射极饱和电压(Vce(sat)@Ic,IF):100mV@1mA,20mA;; LCSC Part Name: DC输入 隔离电压(rms):5000V; Supplier Part: C2684625; Manufacturer: 国芯佳品; Supplier Footprint: SOP-4-250mil-2.54mm; JLCPCB Part Class: 扩展库; Datasheet: https://atta.szlcsc.com/upload/public/pdf/source/20210129/C2684625_70920EABE5B67CAA0A333F7D1CED43F0.pdf; Supplier: LCSC; Input voltage type: DC; Output Type: 光电三极管; Forward Voltage: 1.2V; Output Current: 50mA; Isolation Voltage(rms): 5kV; Reverse Voltage: 6V; Receiving End Voltage: 35V; Number of Outputs: 1; Collector-Emitter Saturation Voltage (Vce(sat)@Ic,IF): 100mV@1mA,20mA; Rise time: 18us@2mA,100Ω; Fall time: 18us@2mA,100Ω; Operating Temperature: -55℃~+110℃
C10 = 20pF: link: https://item.szlcsc.com/362304.html; 3DModel: C0603_L1.6-W0.8-H0.8
CN0 = SWD
LD1 = MHT194CRCGCT: 发光颜色:红色,绿色;透镜颜色:透明透镜;主波长:631nm；567.5nm~575.5nm;发光强度:7.2mcd~18mcd；14.5mcd~38mcd;发光角度:130°;工作温度:-40℃~+85℃;; LCSC Part Name: 0605红黄绿双色光0.4T; Supplier Part: C404274; Manufacturer: MEIHUA(美华); Supplier Footprint: 0606; JLCPCB Part Class: 扩展库; Datasheet: https://atta.szlcsc.com/upload/public/pdf/source/20190830/C404274_5FB0BB819993CF6F881A2FB59C10B943.pdf; Supplier: LCSC; Emitted Color: 红色,绿色; Forward Voltage (VF): 1.6V~2.1V; Forward Current: 5mA; Lens Color: 透明透镜; Dominant Wavelength: 631nm；567.5nm~575.5nm; Luminous Intensity: 7.2mcd~18mcd；14.5mcd~38mcd; Viewing Angle: 130°; Operating Temperature: -40℃~+85℃
R6 R14 = 100K: link: https://item.szlcsc.com/137208.html; 3DModel: R0603_L1.6-W0.8-H0.8
R7 = 2K7: link: https://item.szlcsc.com/137208.html; 3DModel: R0603_L1.6-W0.8-H0.8
R10 = 36K: link: https://item.szlcsc.com/137208.html; 3DModel: R0603_L1.6-W0.8-H0.8
R19 = 0: link: https://item.szlcsc.com/137208.html; 3DModel: R0603_L1.6-W0.8-H0.8
R20 R21 = 200R: link: https://item.szlcsc.com/137208.html; 3DModel: R0603_L1.6-W0.8-H0.8
SB11 SB16 = ShortPad
T1 = S9013: link: https://item.szlcsc.com/9070.html; 3DModel: SOT-23-3P_L2.9-W1.3-H1.0-LS2.4-P0.95; Supplier: LCSC; Supplier Part: C916365; Manufacturer: JSMSEMI
U1 = XC6206P332MR_C5148692: 输出类型:固定;最大输入电压:8V;输出电压:3.3V;输出电流:300mA;输出极性:正;; LCSC Part Name: 输入8V 输出3.3V 300mA; Supplier Part: C5148692; Manufacturer: HXY MOSFET(华轩阳电子); Supplier Footprint: SOT-23; JLCPCB Part Class: Extended Part; Datasheet: https://atta.szlcsc.com/upload/public/pdf/source/20230315/7D5B35EFFBBF81C2EFC36318D2A1A670.pdf; Supplier: LCSC; Output Type: 固定; Maximum Input Voltage: 8V; Output Voltage: 3.3V; Output Current: 300mA; Dropout Voltage: 240mV@(50mA); Output Polarity: 正; Number of Outputs: 1
U2 = STM32F103CBU6: CPU内核:ARM Cortex-M3;CPU最大主频:72MHz;工作电压范围:2V~3.6V;程序存储容量:128KB;程序存储器类型:FLASH;RAM总容量:20KB;GPIO端口数量:37;; Supplier Part: C55506; Manufacturer: ST(意法半导体); Supplier Footprint: UFQFPN-48(7x7); JLCPCB Part Class: Extended Part; Datasheet: https://atta.szlcsc.com/upload/public/pdf/source/20150811/1457707344439.pdf; Supplier: LCSC; CPU Core: ARM Cortex-M3; CPU Maximum Speed: 72MHz; Operating Voltage Range: 2V~3.6V; Program Storage Size: 128KB; Program Memory Type: FLASH; RAM Size: 20KB; GPIO Ports Number: 37; ADC (Bit): 12bit; Universal Serial Bus: 有; Peripheral/Function: 看门狗；DMA；看门狗；片载温度传感器; Watchdog: 有; Infrared Data Association: 有; Low-Voltage Detect: 有; Direct Memory Access: 有; Internal Oscillator: 有; Operating Temperature Range: -40℃~+85℃

## Nets
+3V3: C18.1 C19.1 CN6.2 CN6.4 CN7.14 CN7.18 JP6.2 R23.1 TP8.1 U4.3(VOUT)
+3V3_LINK: C1.2 C4.2 C7.2 C11.2 C12.2 C13.2 CN0.1 JP1.1 R14.1 R19.2 T1.3(C) U1.2(VOUT) U2.1(VBAT) U2.9(VDDA) U2.24(VDD_1) U2.36(VDD_2) U2.48(VDD_3)
+5V: C20.1 C21.1 CN6.5 CN7.20 D50.1(K) JP5.2 R32.1 TP7.1 U4.2(VIN) U51.1 U51.4 U51.5 U52.4(C)
AVDD: C30.1 CN5.8 CN10.9 L1.2 U5.13(VDDA)
GND: B1.1 B1.2 B2.1 B2.2 B90.1 C1.1 C2.1 C4.1 C5.1 C6.1 C7.1 C10.1 C11.1 C12.1 C13.1 C14.1 C16.1 C17.1 C18.2 C19.2 C20.2 C21.2 C23.2 C24.2 C28.2 C29.1 C30.2 C31.2 C32.2 C50.1 C90.2 C91.1 C92.2 C93.1 CN0.4 CN1.1(SHELL) CN1.2(SHELL) CN1.3(SHELL) CN1.4(SHELL) CN1.A1B12(GND) CN1.B1A12(GND) CN5.7 CN6.6 CN6.7 CN7.10 CN7.21 CN7.22 CN7.24 CN10.11 CN10.22 CN10.34 CN11.1 CN11.2 CN12.1 CN12.2 CN50.4(GND) CN50.5(SHLD) CN90.1(SHELL) CN90.2(SHELL) CN90.3(SHELL) CN90.4(SHELL) CN90.A1B12(GND) CN90.B1A12(GND) CN91.1 LD1.2(-) LD2.2 LD3.2 R3.2 R4.2 R6.2 R10.1 R27.1 R29.1 R33.1 R52.2 R80.2 R81.2 R91.2 R92.2 SB11.1 T50.2 TP9.1 U1.1(VSS) U2.8(VSSA) U2.20(PB2) U2.23(VSS_1) U2.35(VSS_2) U2.47(VSS_3) U2.49(EP) U3.1(GND) U4.1(GND) U5.12(VSSA) U5.18(VSS_4) U5.31(VSS_1) U5.47(VSS_2) U5.63(VSS_3) U50.4(VSS) U50.5(EP) U90.9(GND) U90.19(EPAD) U91.3(GND) X1.2 X3.2
VDD: C23.1 C24.1 C28.1 C29.2 C50.2 C91.2 C92.1 C93.2 CN7.7 CN7.35 JP6.1 L1.1 R30.1 R50.1 R51.1 R90.2 R93.1 R94.1 U5.1(VBAT) U5.19(VDD_4) U5.32(VDD_1) U5.48(VDD_2) U5.64(VDD_3) U50.3(VDD) U52.1(A) U90.1(VCC) U91.5(VCC) U91.8(V3)
VIN: C16.2 CN6.8 CN7.26 TP4.1 U3.3(In)
AIN_1: R23.2 R27.2 U2.10(PA0-WKUP)
BOOT0: CN7.9 R33.2 U5.60(BOOT0)
CC11: CN1.A5(CC1) R80.1
CC12: CN1.B5(CC2) R81.1
CC21: CN90.A5(CC1) R92.1
CC22: CN90.B5(CC2) R91.1
DBG_DN: CN90.A7(DN1) CN90.B7(DN2) U91.2(UD-)
DBG_DP: CN90.A6(DP1) CN90.B6(DP2) U91.1(UD+)
DRXI: U90.11(RXD) U91.6(TXD)
DTXO: U90.12(TXD) U91.7(RXD)
E5V: CN7.8 D3.2(A) D4.1(K) JP5.3 R7.2 TP5.1
LED_LINK: R20.1 R21.1 U2.30(PA9)
LINK_RX: CN9.2 CN10.37 U2.13(PA3) U5.16(PA2)
LINK_TX: CN9.1 CN10.39 U2.12(PA2) U5.17(PA3)
MCO: CN7.31 SB16.2 U5.5(PD0-OSC_IN) X3.3
MEN: B90.2 C90.1 R90.1 U90.2(EN)
MIO8: R94.2 U90.7(IO8)
MIO9: CN91.2 R93.2 U90.8(IO9)
MRXI: CN7.3 TP2.1 U5.51(PC10) U90.5(IO6)
MTXO: CN7.4 TP1.1 U5.52(PC11) U90.6(IO7)
NRST: B2.3 B2.4 C14.2 CN6.3 CN7.16 U2.18(PB0) U5.7(NRST)
OSC_IN: U2.5(PD0-OSC_IN) X1.3
OSC_OUT: U2.6(PD1-OSC_OUT) X1.1
PA0: CN7.30 CN8.1 U5.14(PA0-WKUP)
PA1: CN7.32 CN8.2 U5.15(PA1)
PA4: CN7.34 CN8.3 U5.20(PA4)
PA5: CN5.6 CN10.13 R31.1 U5.21(PA5)
PA6: CN5.5 CN10.15 U5.22(PA6)
PA7: CN5.4 CN10.17 U5.23(PA7)
PA8: CN9.8 CN10.25 U5.41(PA8)
PA9: CN5.1 CN10.23 U5.42(PA9)
PA10: CN9.3 CN10.35 U5.43(PA10)
PA11: CN10.16 U5.44(PA11)
PA12: CN10.14 U5.45(PA12)
PA13: CN7.15 R24.2 U2.27(PB14) U5.46(PA13)
PA14: CN7.17 U2.15(PA5) U2.26(PB13) U5.49(PA14)
PA15: CN7.19 U5.50(PA15)
PB0: CN7.36 CN8.4 U5.26(PB0)
PB1: CN10.26 U5.27(PB1)
PB2: CN10.24 U5.28(PB2)
PB3: CN9.4 CN10.33 U2.31(PA10) U5.55(PB3)
PB4: CN9.6 CN10.29 U5.56(PB4)
PB5: CN9.5 CN10.31 U5.57(PB5)
PB6: CN5.3 CN10.19 U5.58(PB6)
PB7: CN7.23 U5.59(PB7)
PB8: CN5.10 CN10.5 R51.2 U5.61(PB8) U50.2(SCL)
PB9: CN5.9 CN10.7 R50.2 U5.62(PB9) U50.1(SDA)
PB10: CN9.7 CN10.27 U5.29(PB10)
PB11: CN10.20 U5.30(PB11)
PB12: CN10.18 U5.33(PB12)
PB13: CN10.32 U5.34(PB13)
PB14: CN10.30 U5.35(PB14)
PB15: CN10.28 U5.36(PB15)
PC0: CN7.40 CN8.6 U5.8(PC0)
PC1: CN7.38 CN8.5 U5.9(PC1)
PC2: CN7.37 U5.10(PC2)
PC3: CN7.39 U5.11(PC3)
PC4: CN10.36 R53.1 U5.24(PC4)
PC5: CN10.8 U5.25(PC5)
PC6: CN10.6 U5.37(PC6)
PC7: CN5.2 CN10.21 U5.38(PC7)
PC8: CN10.4 U5.39(PC8)
PC9: CN10.3 U5.40(PC9)
PC12: CN7.5 U5.53(PC12)
PC13: B1.3 B1.4 C15.2 CN7.25 R30.2 U5.2(PC13-TAMPER-RTC)
PC14: C31.1 CN7.27 U5.3(PC14-OSC32_IN) X2.2
PC15: C32.1 CN7.29 U5.4(PC15-OSC32_OUT) X2.1
PD1: CN7.33 U5.6(PD1-OSC_OUT) X3.1
PD2: CN7.6 U5.54(PD2)
PWR_EXT: JP1.2 R4.1 R7.1 U2.39(PB3)
STM_JTCK: CN0.3 U2.37(PA14)
STM_JTMS: CN0.2 U2.34(PA13)
STM_RST: C6.2 R14.2 SB11.2 U2.7(NRST)
T_SWDIO_IN: R24.1 U2.25(PB12)
U5V: CN1.A4B9(VBUS) CN1.B4A9(VBUS) CN10.10 D2.2(A) JP5.1 R12.2 TP6.1
USB_DN: CN1.A7(DN1) CN1.B7(DN2) U2.32(PA11)
USB_DP: CN1.A6(DP1) CN1.B6(DP2) R16.1 U2.33(PA12)
USB_RE: R11.1 U2.38(PA15)
VCTRL: CN50.1(VCC) LD50.2(A) U51.3 U51.6
$1N62: C15.1 R29.2
$1N103: C17.2 D4.2(A) U3.2(Out) U3.4(TAB)
$1N1133: LD3.1 R32.2
$2N6: R16.2 T1.2(E)
$2N7: R10.2 R11.2 R12.1 T1.1(B)
$2N18: C2.2 C5.2 D2.1(K) D3.1(K) U1.3(VIN)
$2N25: LD1.3(+) R21.2
$2N26: LD1.1(-) R20.2
$2N27: LD1.4(+) R19.1
$2N43: R3.1 U2.2(PC13-TAMPER-RTC)
$2N64: R25.1 U2.29(PA8)
$2N65: C10.2 R25.2 SB16.1
$2N80: R6.1 U2.44(BOOT0)
$3N90: LD2.1 R31.2
$5N600: LD50.1(C) R52.1
$5N1393: R53.2 U52.2(C)
$5N1443: R54.1 TP3.1 U52.3(E)
$5N1445: R54.2 T50.1
$5N1506: D50.2(A) T50.3 U51.8

Not connected (* = marked no-connect by the designer): CN1 A8(SBU1)* B8(SBU2)*; CN6 1*; CN7 1* 2* 11* 12* 13* 28*; CN10 1* 2* 12* 38* 40*; CN50 2(D-)* 3(D+)*; CN90 A4B9(VBUS)* A8(SBU1)* B4A9(VBUS)* B8(SBU2)*; U2 3(PC14-OSC32_IN)* 4(PC15-OSC32_OUT)* 11(PA1)* 14(PA4)* 16(PA6)* 17(PA7)* 19(PB1)* 21(PB10)* 22(PB11)* 28(PB15)* 40(PB4)* 41(PB5)* 42(PB6)* 43(PB7)* 45(PB8)* 46(PB9)*; U51 2* 7*; U90 3(IO4)* 4(IO5)* 10(IO10)* 13(IO18)* 14(IO19)* 15(IO3)* 16(IO2)* 17(IO1)* 18(IO0)*; U91 4(RTS#)*

## Notes on the sheets
sheet 2
- [N/A]
- [OPEN]
